# Altium schematic sheet 01_ZYNQ_POWER.SchDoc
size 420 x 297 mm; SheetNumber: 1; SheetTotal: 7
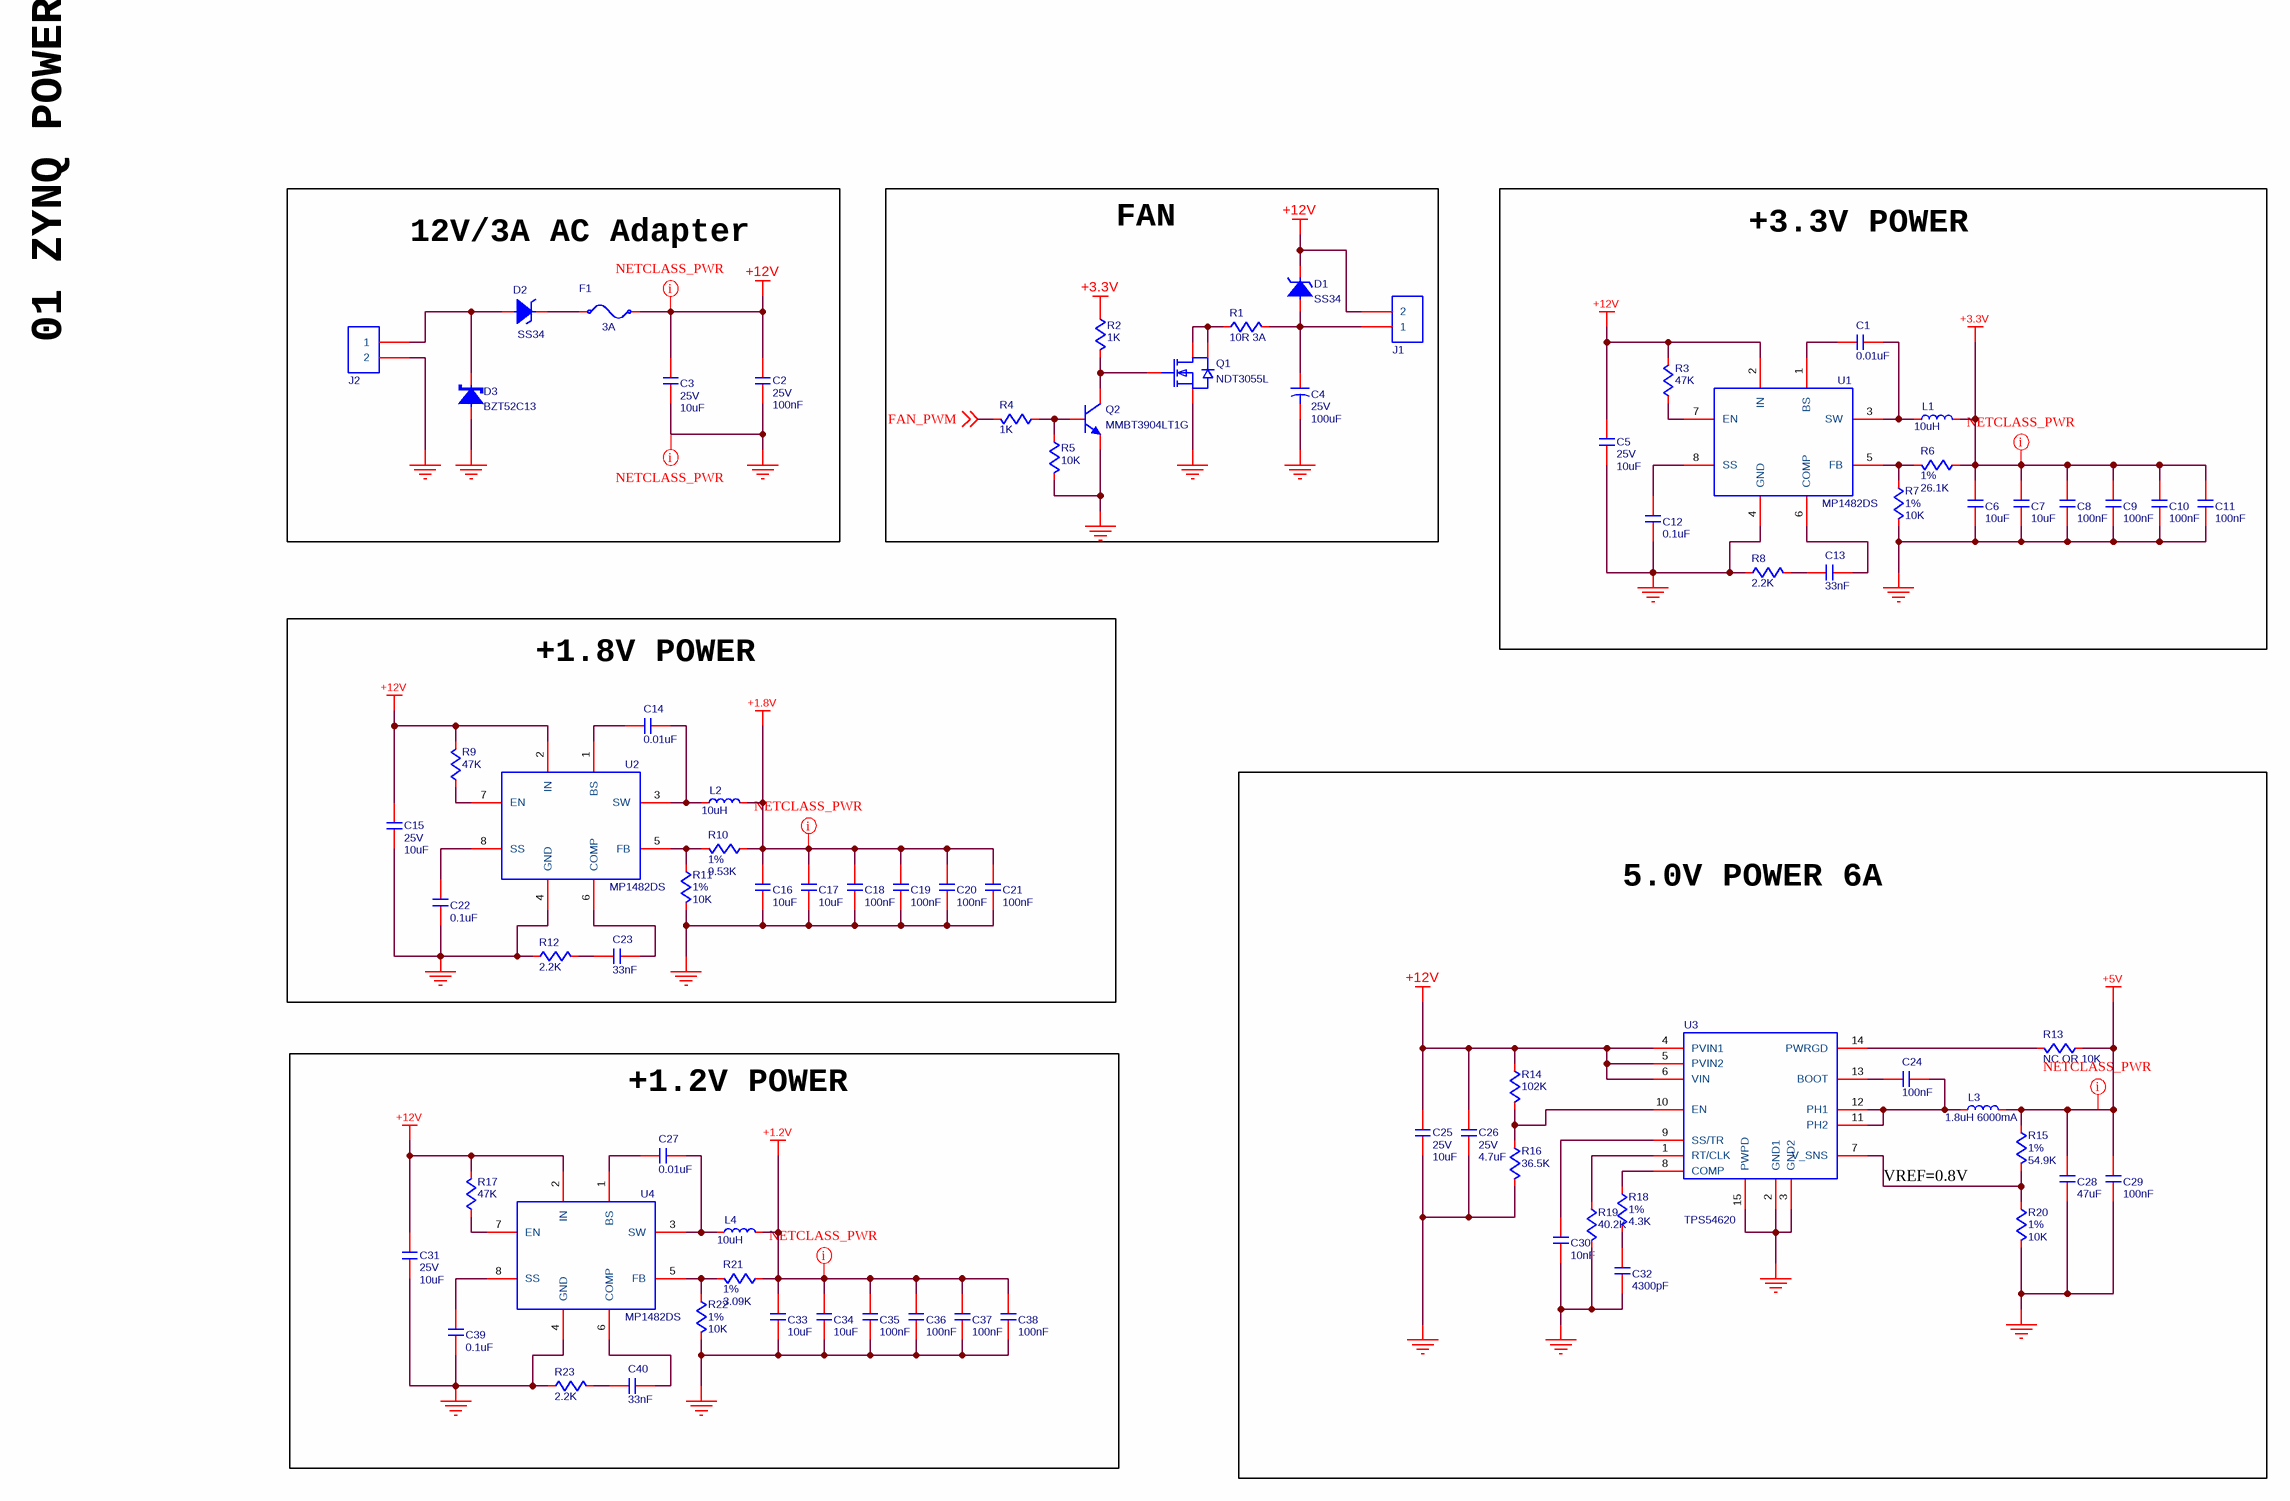
[diagram p0: 01_ZYNQ_POWER.SchDoc]

## Parts
C1  value 0.01uF  [C0402]  (hidden comment: C-NOMO)
C2  value 100nF  voltage: 25V  [C0402]  (hidden comment: C-NOMO)
C3  value 10uF  voltage: 25V  [C0805]  (hidden comment: C-NOMO)
C4  value 100uF  voltage: 25V  [C7343]  (hidden comment: C-POL)
C5  value 10uF  voltage: 25V  [C0805]  (hidden comment: C-NOMO)
C6  value 10uF  [C0805]  (hidden comment: C-NOMO)
C7  value 10uF  [C0805]  (hidden comment: C-NOMO)
C8  value 100nF  [C0402]  (hidden comment: C-NOMO)
C9  value 100nF  [C0402]  (hidden comment: C-NOMO)
C10  value 100nF  [C0402]  (hidden comment: C-NOMO)
C11  value 100nF  [C0402]  (hidden comment: C-NOMO)
C12  value 0.1uF  [C0402]  (hidden comment: C-NOMO)
C13  value 33nF  [C0402]  (hidden comment: C-NOMO)
C14  value 0.01uF  [C0402]  (hidden comment: C-NOMO)
C15  value 10uF  voltage: 25V  [C0805]  (hidden comment: C-NOMO)
C16  value 10uF  [C0805]  (hidden comment: C-NOMO)
C17  value 10uF  [C0805]  (hidden comment: C-NOMO)
C18  value 100nF  [C0402]  (hidden comment: C-NOMO)
C19  value 100nF  [C0402]  (hidden comment: C-NOMO)
C20  value 100nF  [C0402]  (hidden comment: C-NOMO)
C21  value 100nF  [C0402]  (hidden comment: C-NOMO)
C22  value 0.1uF  [C0402]  (hidden comment: C-NOMO)
C23  value 33nF  [C0402]  (hidden comment: C-NOMO)
C24  value 100nF  [C0402]  (hidden comment: C-NOMO)
C25  value 10uF  voltage: 25V  [C0805]  (hidden comment: C-NOMO)
C26  value 4.7uF  voltage: 25V  [C0805]  (hidden comment: C-NOMO)
C27  value 0.01uF  [C0402]  (hidden comment: C-NOMO)
C28  value 47uF  [C0805]  (hidden comment: C-NOMO)
C29  value 100nF  [C0402]  (hidden comment: C-NOMO)
C30  value 10nF  [C0402]  (hidden comment: C-NOMO)
C31  value 10uF  voltage: 25V  [C0805]  (hidden comment: C-NOMO)
C32  value 4300pF  [C0402]  (hidden comment: C-NOMO)
C33  value 10uF  [C0805]  (hidden comment: C-NOMO)
C34  value 10uF  [C0805]  (hidden comment: C-NOMO)
C35  value 100nF  [C0402]  (hidden comment: C-NOMO)
C36  value 100nF  [C0402]  (hidden comment: C-NOMO)
C37  value 100nF  [C0402]  (hidden comment: C-NOMO)
C38  value 100nF  [C0402]  (hidden comment: C-NOMO)
C39  value 0.1uF  [C0402]  (hidden comment: C-NOMO)
C40  value 33nF  [C0402]  (hidden comment: C-NOMO)
D1  SS34  [DO-214AC]
D2  SS34  [DO-214AC]
D3  BZT52C13  [DO-214AC]
F1  3A  [F1812]
J1  HDR1X2  [XH-2A]  (value not drawn)
J2  HDR1X2  [KF301-5.0-2P]  (value not drawn)
L1  value 10uH  [FXL0624]  (hidden comment: L)
L2  value 10uH  [FXL0624]  (hidden comment: L)
L3  value 1.8uH 6000mA  [FXL0624]  (hidden comment: L)
L4  value 10uH  [FXL0624]  (hidden comment: L)
Q1  NDT3055L  [SOT-223]
Q2  MMBT3904LT1G  [SOT-23]
R1  value 10R 3A  [R1812]  (hidden comment: R)
R2  value 1K  [R0402]  (hidden comment: R)
R3  value 47K  [R0402]  (hidden comment: R)
R4  value 1K  [R0402]  (hidden comment: R)
R5  value 10K  [R0402]  (hidden comment: R)
R6  value 26.1K  precision: 1%  [R0402]  (hidden comment: R)
R7  value 10K  precision: 1%  [R0402]  (hidden comment: R)
R8  value 2.2K  [R0402]  (hidden comment: R)
R9  value 47K  [R0402]  (hidden comment: R)
R10  value 9.53K  precision: 1%  [R0402]  (hidden comment: R)
R11  value 10K  precision: 1%  [R0402]  (hidden comment: R)
R12  value 2.2K  [R0402]  (hidden comment: R)
R13  value NC OR 10K  [R0402]  (hidden comment: R)
R14  value 102K  [R0402]  (hidden comment: R)
R15  value 54.9K  precision: 1%  [R0603]  (hidden comment: R)
R16  value 36.5K  [R0402]  (hidden comment: R)
R17  value 47K  [R0402]  (hidden comment: R)
R18  value 4.3K  precision: 1%  [R0402]  (hidden comment: R)
R19  value 40.2K  [R0402]  (hidden comment: R)
R20  value 10K  precision: 1%  [R0603]  (hidden comment: R)
R21  value 3.09K  precision: 1%  [R0402]  (hidden comment: R)
R22  value 10K  precision: 1%  [R0402]  (hidden comment: R)
R23  value 2.2K  [R0402]  (hidden comment: R)
U1  MP1482DS  [MP1482]
U2  MP1482DS  [MP1482]
U3  TPS54620  [TPS54620]
U4  MP1482DS  [MP1482]

## Blocks framed on the sheet
12V/3A AC Adapter: C2 C3 D2 D3 F1 J2
FAN: C4 D1 J1 Q1 Q2 R1 R2 R4 R5
+3.3V POWER: C1 C5-C13 L1 R3 R6-R8 U1
+1.8V POWER: C14-C23 L2 R9-R12 U2
5.0V POWER 6A: C24-C26 C28-C30 C32 L3 R13-R16 R18-R20 U3
+1.2V POWER: C27 C31 C33-C40 L4 R17 R21-R23 U4

## Nets
+1.2V: C33.2 C34.2 C35.2 C36.2 C37.2 C38.2 L4.2 R21.2
+1.8V: C16.2 C17.2 C18.2 C19.2 C20.2 C21.2 L2.2 R10.2
+3.3V: C6.2 C7.2 C8.2 C9.2 C10.2 C11.2 L1.2 R2.2 R6.2
+5V: C28.1 C29.1 L3.2 R13.2 R15.2
+12V: C2.2 C3.2 C5.2 C15.2 C25.2 C26.2 C31.2 D1.1 F1.2 J1.2 R3.1 R9.1 R14.2 R17.1 U1.2(IN) U2.2(IN) U3.4(PVIN1) U3.5(PVIN2) U3.6(VIN) U4.2(IN)
GND: C2.1 C3.1 C4.2 C5.1 C6.1 C7.1 C8.1 C9.1 C10.1 C11.1 C12.1 C15.1 C16.1 C17.1 C18.1 C19.1 C20.1 C21.1 C22.1 C25.1 C26.1 C28.2 C29.2 C30.1 C31.1 C32.1 C33.1 C34.1 C35.1 C36.1 C37.1 C38.1 C39.1 D3.2 J2.2 Q1.3(S) Q2.2(E) R5.1 R7.1 R8.2 R11.1 R12.2 R16.1 R19.1 R20.1 R22.1 R23.2 U1.4(GND) U2.4(GND) U3.2(GND1) U3.3(GND2) U3.15(PWPD) U4.4(GND)
FAN_PWM: R4.1 ; off-sheet FAN_PWM
NetC1_1: C1.1 L1.1 U1.3(SW)
NetC1_2: C1.2 U1.1(BS)
NetC4_1: C4.1 D1.2 J1.1 R1.1
NetC12_2: C12.2 U1.8(SS)
NetC13_1: C13.1 U1.6(COMP)
NetC13_2: C13.2 R8.1
NetC14_1: C14.1 L2.1 U2.3(SW)
NetC14_2: C14.2 U2.1(BS)
NetC22_2: C22.2 U2.8(SS)
NetC23_1: C23.1 U2.6(COMP)
NetC23_2: C23.2 R12.1
NetC24_1: C24.1 L3.1 U3.11(PH2) U3.12(PH1)
NetC24_2: C24.2 U3.13(BOOT)
NetC27_1: C27.1 L4.1 U4.3(SW)
NetC27_2: C27.2 U4.1(BS)
NetC30_2: C30.2 U3.9(SS/TR)
NetC32_2: C32.2 R18.1
NetC39_2: C39.2 U4.8(SS)
NetC40_1: C40.1 U4.6(COMP)
NetC40_2: C40.2 R23.1
NetD2_1: D2.1 F1.1
NetD2_2: D2.2 D3.1 J2.1
NetQ1_1: Q1.1(G) Q2.3(C) R2.1
NetQ1_2: Q1.2(D) Q1.4(D) R1.2
NetQ2_1: Q2.1(B) R4.2 R5.2
NetR3_2: R3.2 U1.7(EN)
NetR6_1: R6.1 R7.2 U1.5(FB)
NetR9_2: R9.2 U2.7(EN)
NetR10_1: R10.1 R11.2 U2.5(FB)
NetR13_1: R13.1 U3.14(PWRGD)
NetR14_1: R14.1 R16.2 U3.10(EN)
NetR15_1: R15.1 R20.2 U3.7(V_SNS)
NetR17_2: R17.2 U4.7(EN)
NetR18_2: R18.2 U3.8(COMP)
NetR19_2: R19.2 U3.1(RT/CLK)
NetR21_1: R21.1 R22.2 U4.5(FB)

## Layout directives
net class NETCLASS_PWR: +1.2V, +1.8V, +3.3V, +5V, +12V, GND

## Notes on the sheet
- 01 ZYNQ POWER
- VREF=0.8V
- THIS DOCUMENT AND THE DATA DISCLOSED HEREIN OR
- HEREWITH IS THE PROPERTY OF ALTIUM LIMITED AND MAY
- DWG NO:
- REVISION
- REV:
- DESCRIPTION
- DATE
- APPROVED
- BE FREELY DISTRIBUTED IN WHOLE. NO RIGHTS ARE
- RESERVED OR EXPRESS OR IMPLIED WARANTEE GIVEN.
- ENG:
- APPROVALS
- PROJECT
- DSN:
- CHK:
- REFERENCE DOCUMENTS
- PROJECT REVISION:
- TITLE
- DOCUMENT REVISION:
- DESIGN ITEM:
- BOM:
- FAB DWG:
- PCB DWG:
- ASSY DWG:
- SCALE:
- A3
- SIZE
- CAGE CODE
- FILE NAME
- DWG NO.
- SHEET
- OF
- REV

## Library data of the parts
C1 C6-C14 C16-C24 C27-C30 C32-C40 = C-NOMO: voltage: 25V; precision: 5%
C2 C3 C5 C15 C25 C26 C31 = C-NOMO: precision: 5%
D1 D2 = DIOD2: BAS16XV2T1G
D3 = DIOD3
F1 = FUSE
L1-L4 = L: Code_IEC: 1005; Published: 8-Jun-2000; LatestRevisionDate: 29-May-2009; LatestRevisionNote: IPC-7351 Footprint Added.; PackageReference: 0402-A; Publisher: Altium Limited; PackageDescription: Chip Inductor; Code_JEITA: 0402
Q2 = NPN
R1-R5 R8 R9 R12-R14 R16 R17 R19 R23 = R: precision: 1%